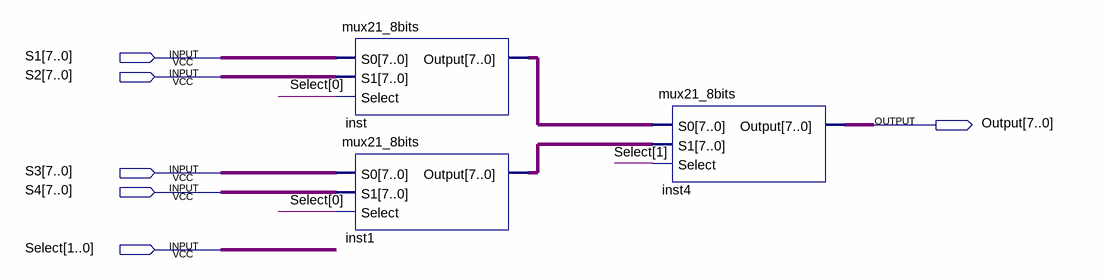
[diagram p0: schematic sheet]
// Quartus schematic Selector4to1.bdf as structural Verilog: 3 symbols, 6 pins
module Selector4to1 (
  input  [7:0] S1,
  input  [7:0] S2,
  input  [7:0] S3,
  input  [7:0] S4,
  input  [1:0] Select,
  output [7:0] Output
);

  wire [7:0] inst1_output, inst_output;

  mux21_8bits inst (.S0(S1), .S1(S2), .Select(Select[0]), .Output(inst_output));
  mux21_8bits inst1 (.S0(S3), .S1(S4), .Select(Select[0]), .Output(inst1_output));
  mux21_8bits inst4 (.S0(inst_output), .S1(inst1_output), .Select(Select[1]), .Output(Output));
endmodule
